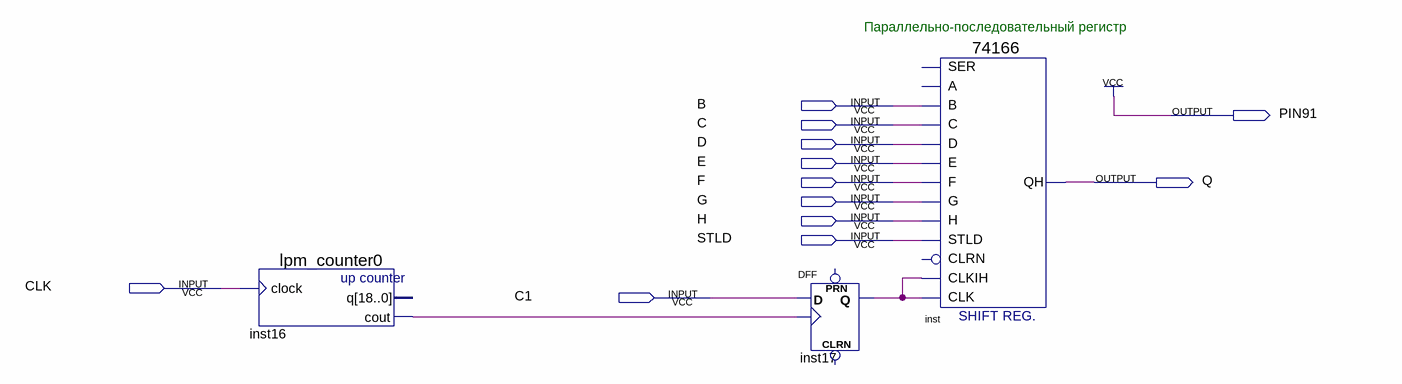
[diagram p0: schematic sheet]
// Quartus schematic Registers_2.bdf as structural Verilog: 3 symbols, 12 pins
module Registers_2 (
  input  B,
  input  C,
  input  D,
  input  E,
  input  F,
  input  G,
  input  H,
  input  STLD,
  input  CLK,
  input  C1,
  output PIN91,
  output Q
);

  wire inst16_cout, inst17_q;

  lpm_counter0 inst16 (.clock(CLK), .cout(inst16_cout));  // open: q
  DFF inst17 (.CLK(inst16_cout), .D(C1), .Q(inst17_q));  // open: CLRN, PRN
  \74166  inst (
    .C(C), .D(D), .E(E), .B(B), .STLD(STLD), .H(H), .G(G), .F(F), .CLK(inst17_q), .CLKIH(inst17_q), .QH(Q));  // open: SER, A, CLRN

  assign PIN91 = 1'b1;

  // Notes on the sheet:
  //   Параллельно-последовательный регистр
endmodule
